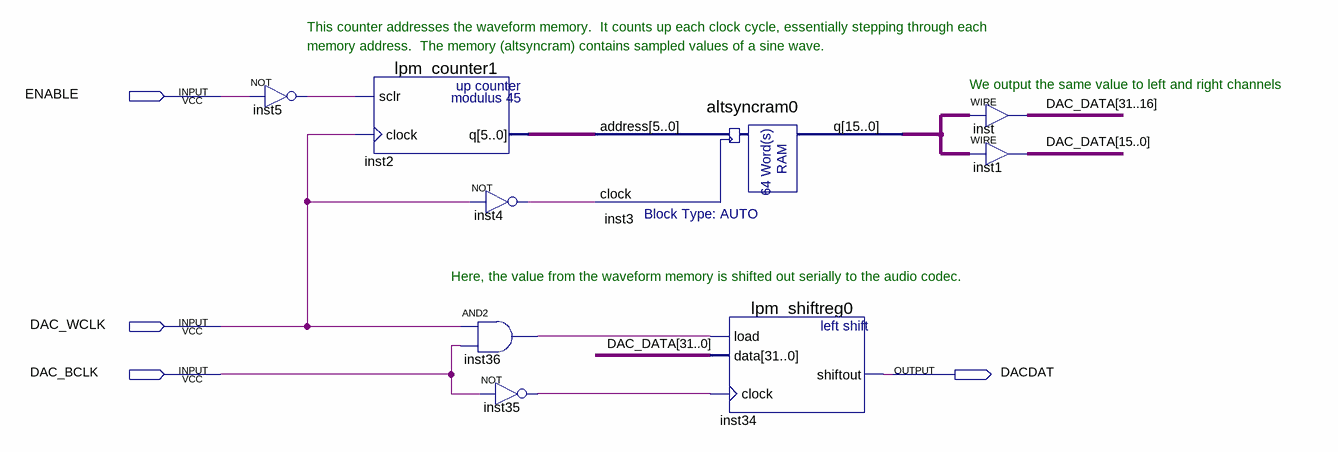
[diagram p0: schematic sheet]
// Quartus schematic DAC_BEEP.bdf as structural Verilog: 9 symbols, 4 pins
module DAC_BEEP (
  input  ENABLE,
  input  DAC_WCLK,
  input  DAC_BCLK,
  output DACDAT
);

  wire inst4_out, inst5_out, inst35_out, inst36_out;
  wire [5:0] inst2_q;
  wire [15:0] inst3_q;
  wire [31:0] DAC_DATA;

  not inst5 (inst5_out, ENABLE);
  lpm_counter1 inst2 (.sclr(inst5_out), .clock(DAC_WCLK), .q(inst2_q));
  not inst4 (inst4_out, DAC_WCLK);
  and inst36 (inst36_out, DAC_WCLK, DAC_BCLK);
  not inst35 (inst35_out, DAC_BCLK);
  altsyncram0 inst3 (.address(inst2_q), .clock(inst4_out), .q(inst3_q));
  lpm_shiftreg0 inst34 (.load(inst36_out), .data(DAC_DATA), .clock(inst35_out), .shiftout(DACDAT));
  assign DAC_DATA[31:16] = inst3_q;  // WIRE inst
  assign DAC_DATA[15:0] = inst3_q;  // WIRE inst1

  // Notes on the sheet:
  //   This counter addresses the waveform memory.  It counts up each clock cycle, essentially stepping through each
  //   memory address.  The memory (altsyncram) contains sampled values of a sine wave.
  //   We output the same value to left and right channels
  //   Here, the value from the waveform memory is shifted out serially to the audio codec.
endmodule
